# EAGLE design soundfield_board_40720_15mm (EAGLE 8.0.2)
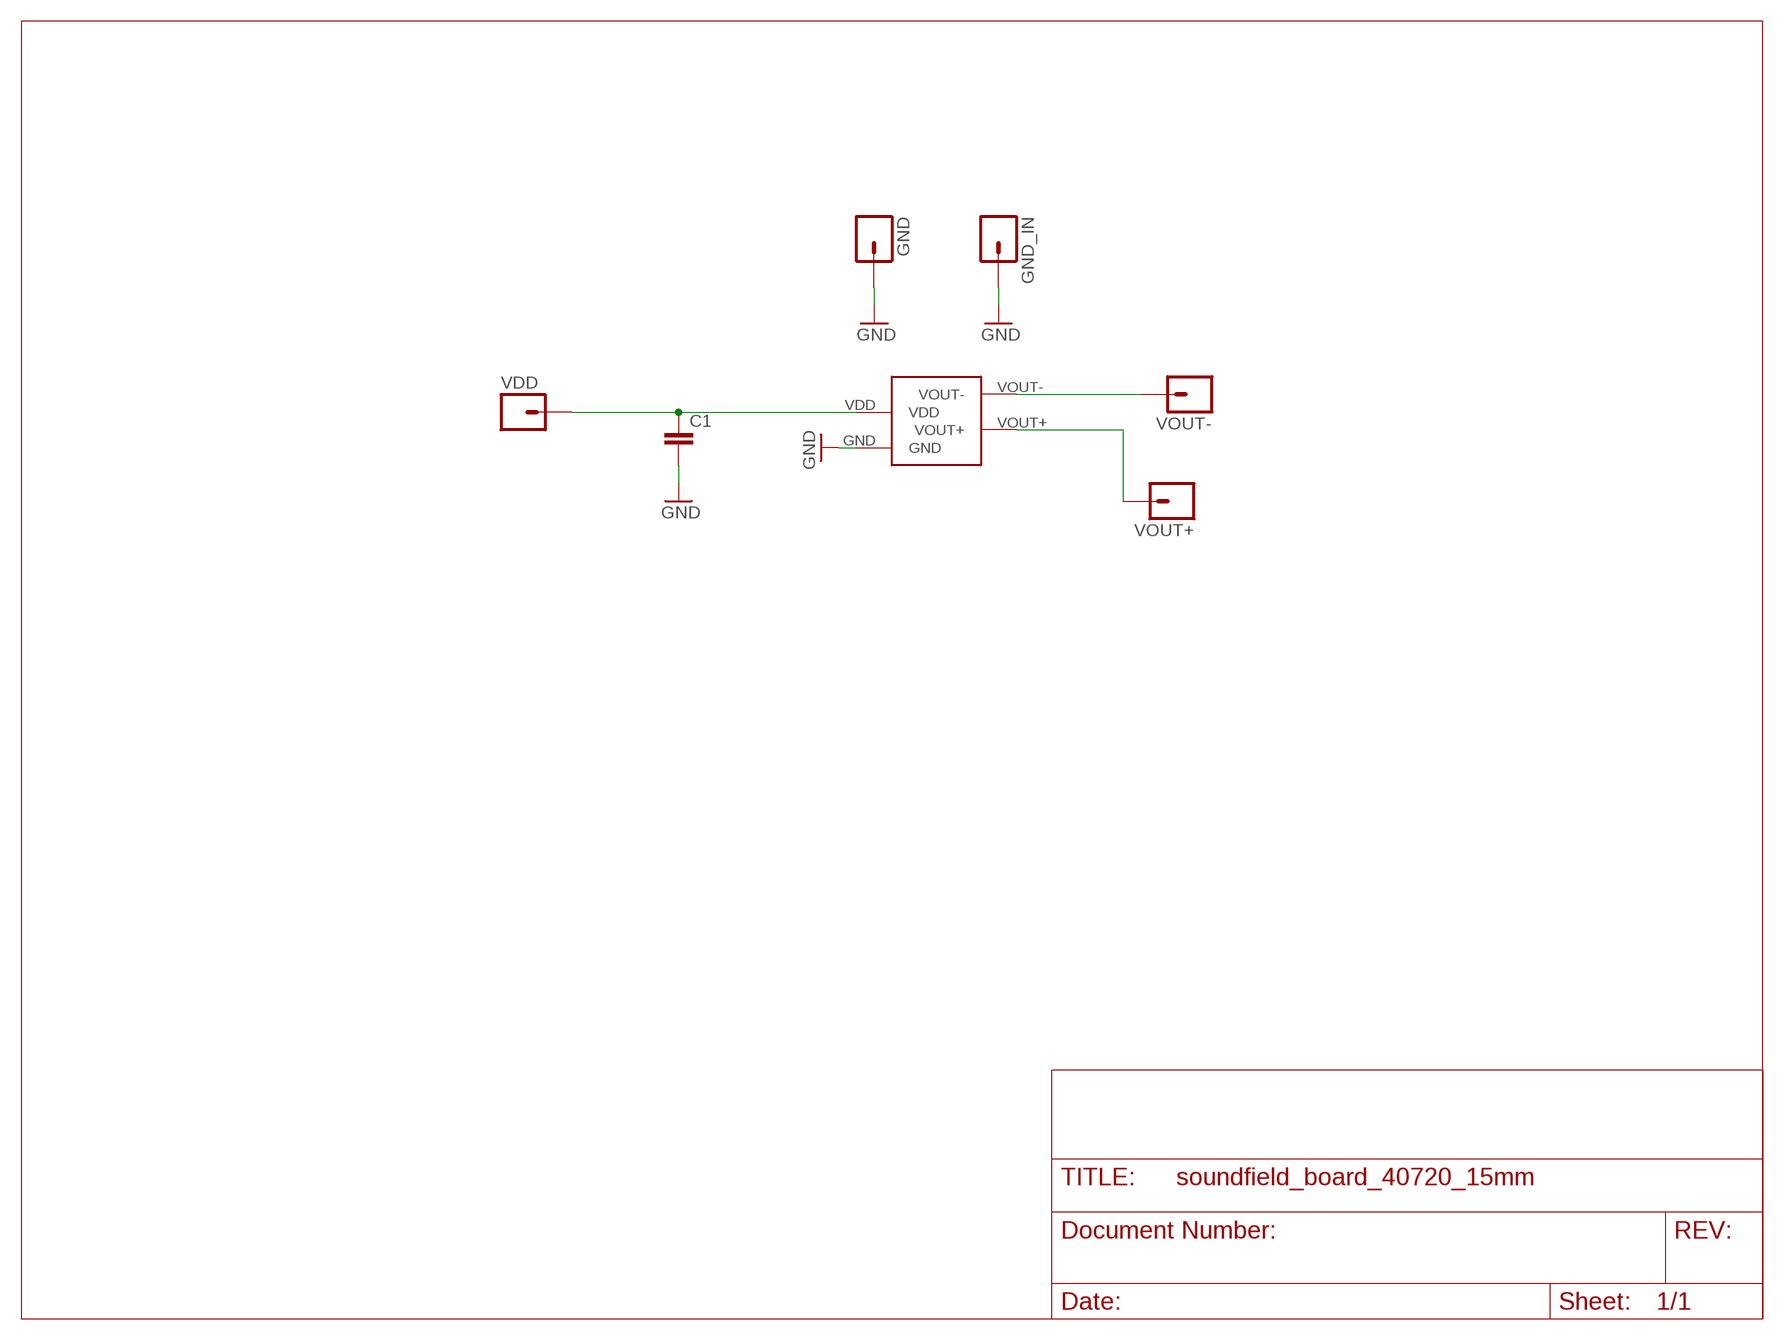
[diagram p0: schematic, sheet 1]

## Parts
C1  0.1UF-16V(+-10%)(0402)  [0402-CAP]
GND  M01PTH_NO_SILK_YES_STOP  [1X01_NO_SILK]
GND_IN  M01PTH_NO_SILK_YES_STOP  [1X01_NO_SILK]
U$1  MEMS_ICS_40720  [ MEMS_ICS_40720]
VDD  M01PTH_NO_SILK_YES_STOP  [1X01_NO_SILK]
VOUT+  M01PTH_NO_SILK_YES_STOP  [1X01_NO_SILK]
VOUT-  M01PTH_NO_SILK_YES_STOP  [1X01_NO_SILK]

## Nets
GND: C1.2 GND.1 GND_IN.1 U$1.GND
VDD: C1.1 U$1.VDD VDD.1
VOUT+: U$1.VOUT+ VOUT+.1
VOUT-: U$1.VOUT- VOUT-.1

## Library data of the parts
C1 = SparkFun-Capacitors:0.1UF-16V(+-10%)(0402); PROD_ID: CAP-12416; VALUE: 0.1uF
GND = CM-SparkFun-Connectors-large_hole:M01: Header 1 Standard 1-pin 0.1" header. Use with straight break away headers (SKU : PRT-00116), right angle break away headers (PRT-00553), swiss pins (PRT-00743), machine pins (PRT-00117), and female headers (PRT-00115). SMTSO-256-ET is a "flush mount" nut for a 4-40 screw. The older package used to be too tight, and did not allow it to sit properly thru the drill hit. The latest (0.165DIA) fits nice and snug.
GND_IN VDD VOUT+ VOUT- = CM-SparkFun-Connectors:M01: Header 1 Standard 1-pin 0.1" header. Use with straight break away headers (SKU : PRT-00116), right angle break away headers (PRT-00553), swiss pins (PRT-00743), machine pins (PRT-00117), and female headers (PRT-00115). SMTSO-256-ET is a "flush mount" nut for a 4-40 screw. The older package used to be too tight, and did not allow it to sit properly thru the drill hit. The latest (0.165DIA) fits nice and snug.
U$1 = mems_ICS_40720: MEMS_ICS_40720

## Net classes
0 default: clearance 0.205 mm

## Board
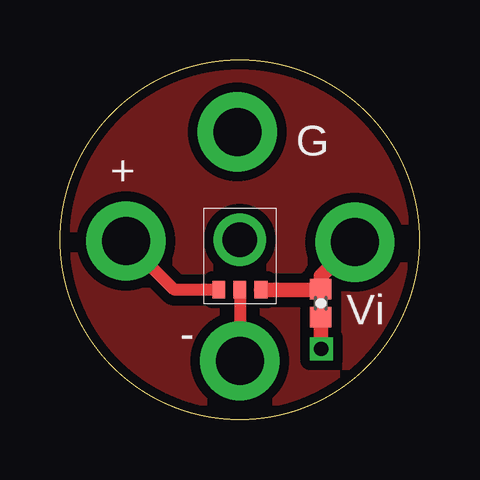
[diagram p1: board, top side]
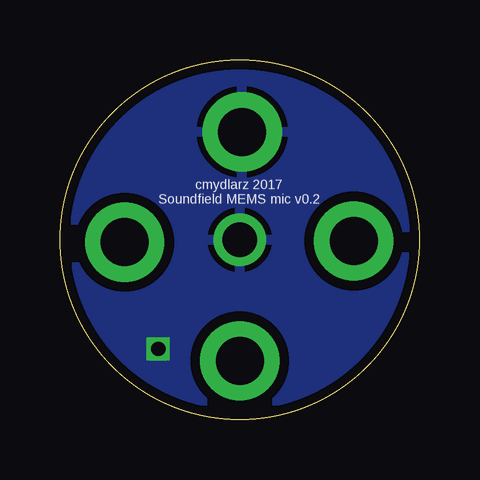
[diagram p2: board, bottom side, seen from below]

Size 15 x 15 mm. Coordinates in mm from the lower left corner, seen from the top.
Outline: circle at 7.5,7.5 radius 7.5
Copper layers (1*16): Top 0.0356mm / dielectric 1.5011mm / Bottom 0.0356mm
Design rules "oshpark-2layer *": minimum track width 6mil, minimum drill 13mil, track to track 6mil, track to pad 6mil, pad to pad 6mil, via to via 6mil, smd to smd 6mil, copper to edge 15mil, drill to drill 6mil, minimum pad ring 7mil, minimum via ring 7mil, stop-mask expansion 0mil, vias tented up to drill 20mil, thermal gap 10mil

### Footprints (pad centres in the part's own frame; a part is rotated, then mirrored left to right if it is on the bottom)
0402-CAP = smd 0.85 x 0.9: 1 -0.58,0; 2 0.58,0
1X01_NO_SILK = drill 1.45 pad 2.14: 1 0,0
1X01_2MM = drill 2 pad 3.302: 1 0,0
 MEMS_ICS_40720 = smd 2.14 x 2.14: GND 1.5,2.68 | smd 0.53 x 0.73: VDD 2.385,0.595; VOUT+ 0.625,0.595; VOUT- 1.505,0.595

### Placement (x,y rotation side)
C1  10.88,4.85 270 top
GND  7.5,7.5 0 top
GND_IN  [1X01_2MM]  7.4,12 270 top
U$1  6,4.82 0 top
VDD  [1X01_2MM]  12.3,7.4 0 top
VOUT+  [1X01_2MM]  2.75,7.45 270 top
VOUT-  [1X01_2MM]  7.5,2.45 0 top

### Tracks (layer width: path | path; a pad name or v marks a point on that pad's centre or on a via)
GND  (via drill 0.6)
  Top 0.61: C1.2 10.88,3.07 10.9,3.05 v10.9,2.95
  pour Bottom (isolate 0.406): 14.8,7.55 arc-90 7.45,0.2 7.4,0.2 arc-90 0.2,7.4 0.2,7.45 arc-90 7.55,14.8 7.65,14.8 7.7,14.8 arc-90 14.8,7.7
N$1
  pour Top (isolate 0.406): 0.25,7.5 arc-90 7.5,14.75 7.55,14.75 arc-90 14.8,7.5 arc-90 7.5,0.2 7.45,0.2 arc-90 0.25,7.4
VDD
  Top 0.61: U$1.VDD 10.87,5.42 C1.1 10.88,5.98 VDD.1
VOUT+
  Top 0.305: 6.38,5.42 U$1.VOUT+
  Top 0.5: U$1.VOUT+ 4.79,5.42 VOUT+.1
VOUT-
  Top 0.406: U$1.VOUT-
  Top 0.5: U$1.VOUT- VOUT-.1

### Text on the board
tNames: G | + | Vi | -
bNames: cmydlarz 2017 / Soundfield MEMS mic v0.2